# Altium schematic sheet hv.SchDoc: FastIC+ readout
size 297 x 209 mm; Organization: CERN; SheetNumber: 5; SheetTotal: 6; Projet: Fast Timing; ModifiedDate: -
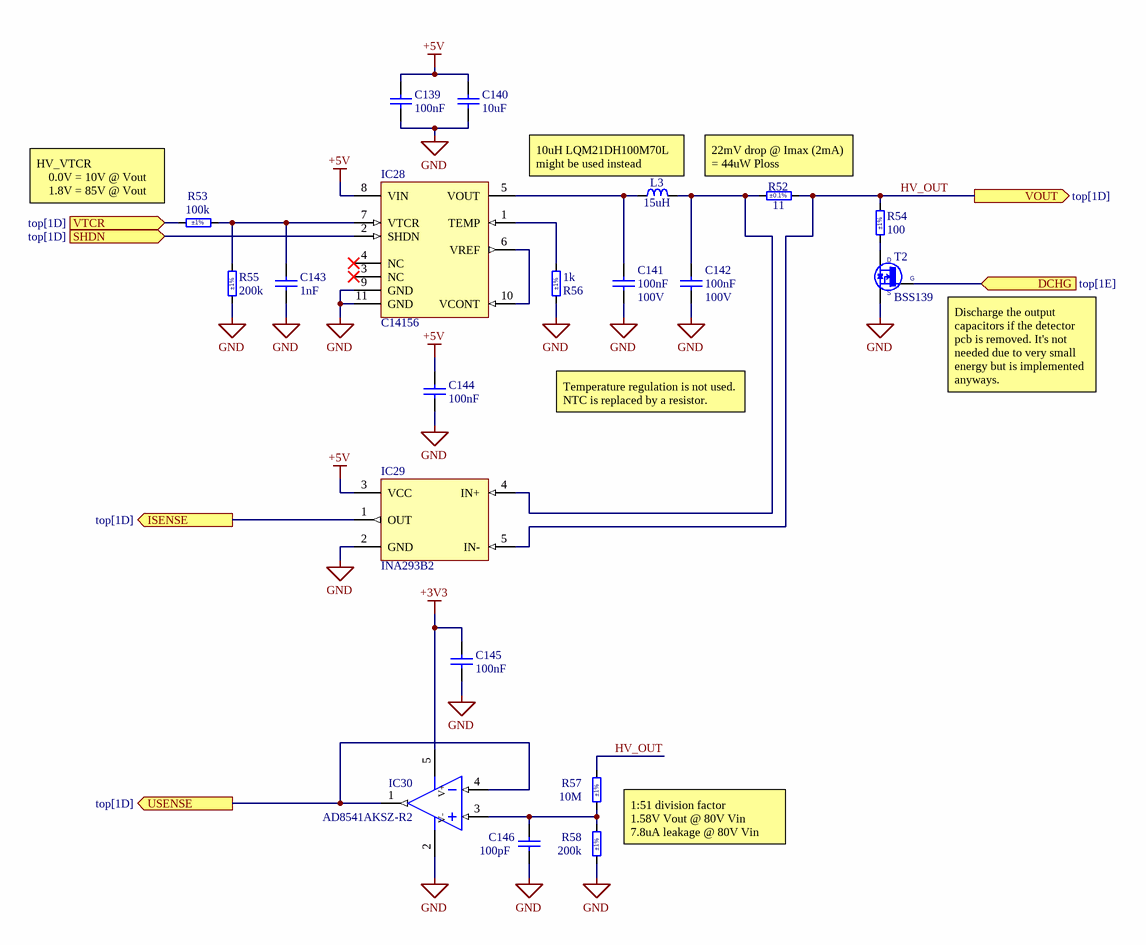
[diagram p0: hv.SchDoc]

## Parts
C139  100nF  [CAPC1005X55N]
C140  10uF  [CAPC1608X80N]
C141  100nF  Voltage: 100V  [CAPC1608X90N]
C142  100nF  Voltage: 100V  [CAPC1608X90N]
C143  1nF  [CAPC1005X55N]
C144  100nF  [CAPC1005X55N]
C145  100nF  [CAPC1005X55N]
C146  100pF  [CAPC1005X55N]
IC28  C14156  [C14156]  (no BOM)
IC29  INA293B2  [SOT95P280X145-5N]
IC30  AD8541AKSZ-R2  [SOT65P210X110-5N]
L3  15uH  [INDC2013X145N]
R52  11  Tolerance: ±0.1%  [RESC1608X55N]
R53  100k  Tolerance: ±1%  [RESC1005X40N]
R54  100  Tolerance: ±1%  [RESC1005X40N]
R55  200k  Tolerance: ±1%  [RESC1005X40N]
R56  1k  Tolerance: ±1%  [RESC1005X40N]
R57  10M  Tolerance: ±1%  [RESC1005X35N]
R58  200k  Tolerance: ±1%  [RESC1005X40N]
T2  BSS139  [SOT95P240X110-3N]

## Ports
DCHG (in, see top[1E]), ISENSE (out, see top[1D]), SHDN (in, see top[1D]), USENSE (out, see top[1D]), VOUT (out, see top[1D]), VTCR (in, see top[1D])

## Nets
+3V3: C145.2 IC30.5(V+)
+5V: C139.2 C140.1 C144.2 IC28.8(VIN) IC29.3(VCC)
GND: C139.1 C140.2 C141.1 C142.1 C143.2 C144.1 C145.1 C146.1 IC28.9(GND) IC28.11(GND) IC29.2(GND) IC30.2(V-) R55.1 R56.1 R58.1 T2.2(S)
DCHG: T2.1(G) ; port DCHG
HV_OUT: IC29.5(IN-) R52.2 R54.2 R57.2 ; port VOUT
ISENSE: IC29.1(OUT) ; port ISENSE
SHDN: IC28.2(SHDN) ; port SHDN
USENSE: IC30.1(OUT) IC30.4(IN-) ; port USENSE
VTCR: R53.1 ; port VTCR
NetC141_2: C141.2 IC28.5(VOUT) L3.1
NetC142_2: C142.2 IC29.4(IN+) L3.2 R52.1
NetC143_1: C143.1 IC28.7(VTCR) R53.2 R55.2
NetC146_2: C146.2 IC30.3(IN+) R57.1 R58.2
NetIC28_1: IC28.1(TEMP) R56.2
NetIC28_6: IC28.6(VREF) IC28.10(VCONT)
NetR54_1: R54.1 T2.3(D)

Not connected (* = marked no-connect by the designer): IC28 3(NC)* 4(NC)*

## Notes on the sheet
- (near R53) HV_VTCR
  0.0V = 10V @ Vout
  1.8V = 85V @ Vout
- (near L3) 10uH LQM21DH100M70L might be used instead
- (near R52) 22mV drop @ Imax (2mA)
  = 44uW Ploss
- (near T2) Discharge the output capacitors if the detector pcb is removed. It's not needed due to very small energy but is implemented anyways.
- Temperature regulation is not used. NTC is replaced by a resistor.
- 1:51 division factor
  1.58V Vout @ 80V Vin
  7.8uA leakage @ 80V Vin
- Project/Equipment
- Document
- Designer
- Drawn by
- Check.by
- File
- Last Mod.
- Print Date
- Sheet
- Size
- A4
- of
- Rev

## Library data of the parts
C139 C144 C145 = CC0402_100NF_16V_10%_X7R: Non-polarised capacitor; Part Description: SMD Multilayer Chip Ceramic Capacitor; Manufacturer: GENERIC; Manufacturer1 Part Number: GRM155R71C104KA88D; Voltage: 16V; TC: X7R; Tolerance: ±10%; Part Number: CC0402_100NF_16V_10%_X7R; Component Kind: Standard; Component Type: Standard; Pin Count: 2; Value: 100nF; Status: Not Recommended; Manufacturer Part Number: CC0402_100NF_16V_10%_X7R; Case: 0402; Mounted: Yes; Socket: No; SMD: Yes; Sense: No; Manufacturer1 Example: MURATA; Manufacturer1 ComponentHeight: 0.55mm; HelpURL: \\cern.ch\dfs\Applications\Altium\Datasheets\CC0402_X7R_MURATA_GRM.pdf; Author: CERN DEM JLC; CreateDate: 05/12/2013; LatestRevisionDate: 03/12/2007
C140 = CC0603_10UF_10V_10%_X5R: Non-polarised capacitor; Part Description: SMD Multilayer Chip Ceramic Capacitor; Manufacturer: GENERIC; Manufacturer1 Part Number: GRM188R61A106KE69D; Voltage: 10V; TC: X5R; Tolerance: ±10%; Part Number: CC0603_10UF_10V_10%_X5R; Component Kind: Standard; Component Type: Standard; Pin Count: 2; Value: 10uF; Status: None; Manufacturer Part Number: CC0603_10UF_10V_10%_X5R; Case: 0603; Mounted: Yes; Socket: No; SMD: Yes; Sense: No; Manufacturer1 Example: MURATA; Manufacturer1 ComponentHeight: 0.8mm; HelpURL: \\cern.ch\dfs\Applications\Altium\Datasheets\CC0603_MURATA_GRM188R61A106KE69D.pdf; Author: CERN DEM JLC; CreateDate: 31/01/2017; LatestRevisionDate: 31/01/2017
C141 C142 = CC0603_100NF_100V_10%_X7R: Non-polarised capacitor; Part Description: SMD Multilayer Chip Ceramic Capacitor; Manufacturer: GENERIC; Manufacturer1 Part Number: GRM188R72A104KA35D; TC: X7R; Tolerance: ±10%; Part Number: CC0603_100NF_100V_10%_X7R; Component Kind: Standard; Component Type: Standard; Pin Count: 2; Value: 100nF; Status: None; Manufacturer Part Number: CC0603_100NF_100V_10%_X7R; Case: 0603; Mounted: Yes; Socket: No; SMD: Yes; Sense: No; Manufacturer1 Example: MURATA; Manufacturer1 ComponentHeight: 0.9mm; HelpURL: \\cern.ch\dfs\Applications\Altium\Datasheets\CC0603_MURATA_GRM188R72A104KA35D.pdf; Author: CERN DEM JLC; CreateDate: 11/12/2013; LatestRevisionDate: 11/12/2013
C143 = CC0402_1NF_50V_10%_X7R: Non-polarised capacitor; Part Description: SMD Multilayer Chip Ceramic Capacitor; Manufacturer: GENERIC; Manufacturer1 Part Number: 223858715623; Voltage: 50V; TC: X7R; Tolerance: ±10%; Part Number: CC0402_1NF_50V_10%_X7R; Component Kind: Standard; Component Type: Standard; Pin Count: 2; Value: 1nF; Status: Not Recommended; Manufacturer Part Number: CC0402_1NF_50V_10%_X7R; Case: 0402; Mounted: Yes; Socket: No; SMD: Yes; Sense: No; Manufacturer1 Example: PHYCOMP; Manufacturer1 ComponentHeight: 0.55mm; HelpURL: \\cern.ch\dfs\Applications\Altium\Datasheets\CC0402_X7R_PHYCOMP.pdf; Author: CERN DEM JLC; CreateDate: 03/12/2007; LatestRevisionDate: 03/12/2007
C146 = CC0402_100PF_50V_5%_C0G: Non-polarised capacitor; Part Description: SMD Multilayer Chip Ceramic Capacitor; Manufacturer: GENERIC; Manufacturer1 Part Number: C0402C101J5GACTU; Voltage: 50V; TC: C0G/NP0; Tolerance: ±5%; Part Number: CC0402_100PF_50V_5%_C0G; Component Kind: Standard; Component Type: Standard; Pin Count: 2; Value: 100pF; Status: Preferred; Manufacturer Part Number: CC0402_100PF_50V_5%_C0G; Case: 0402; Mounted: Yes; Socket: No; SMD: Yes; Sense: No; Manufacturer1 Example: KEMET; Manufacturer1 ComponentHeight: 0.55mm; HelpURL: \\cern.ch\dfs\Applications\Altium\Datasheets\CC0402_C0G_KEMET_(Commercial Grade).pdf; Author: CERN DEM JLC; CreateDate: 12/3/2007; LatestRevisionDate: 4/22/2015
IC30 = AD8541AKSZ-R2: Operational Amplifier; Part Description: CMOS Rail-to-Rail General-Purpose Amplifier; Manufacturer: ANALOG DEVICES; PressFit: No; Bonding: No; Part Number: AD8541AKSZ-R2; Component Kind: Standard; Component Type: Standard; Device: AD8541AKSZ-R2; PackageDescription: SOT353, SC70-5, SOT, 0.65mm Pitch; 5 Pin, 1.25mm W X 2.00mm L X 1.10mm H body, IPC Medium Density; Manufacturer Part Number: AD8541AKS; Pin Count: 5; Case: SOT353; Mounted: Yes; Socket: No; SMD: Yes; Sense: No; ComponentHeight: 1.1mm; Author: CERN DEM JLC; HelpURL: \\cern.ch\dfs\Applications\Altium\Datasheets\AD8541AKSZ-R2.pdf; CreateDate: 4/25/2012; LatestRevisionDate: 3/29/2022
L3 = IND0805_TDK_MLZ2012M150WT000: Inductor; Part Description: SMD Multilayer Ferrite (MLZ Series); Manufacturer: TDK; Power: 100mA; Resistance: 0.95R; Tolerance: ±20%; Part Number: IND0805_TDK_MLZ2012M150WT000; Component Kind: Standard; Component Type: Standard; Pin Count: 2; Value: 15uH; Manufacturer Part Number: MLZ2012M150WT000; Case: 0805; Mounted: Yes; Socket: No; SMD: Yes; Sense: No; ComponentHeight: 1.45mm; HelpURL: \\cern.ch\dfs\Applications\Altium\Datasheets\IND0805_TDK_MLZ2012.pdf; Author: CERN DEM HF; CreateDate: 4/18/2024; LatestRevisionDate: 4/18/2024
R52 = R0603_11R_0.1%_0.063W_10PPM: Resistor - 0.1%; Part Description: Thin Film Chip Resistor; Manufacturer: GENERIC; Manufacturer1 Part Number: RN73C1J11RBTDF; Power: 0.063W; TC: ±10ppm; PressFit: No; Part Number: R0603_11R_0.1%_0.063W_10PPM; Component Kind: Standard; Component Type: Standard; Pin Count: 2; Value: 11; Status: Not Recommended; Manufacturer Part Number: R0603_11R_0.1%_0.063W_10PPM; Case: 0603; Mounted: Yes; Sense: No; Socket: No; SMD: Yes; Manufacturer1 Example: TYCO HOLSWORTHY; Manufacturer1 ComponentHeight: 0.5mm; HelpURL: \\cern.ch\dfs\Applications\Altium\Datasheets\R0603_Tyco_RN73.pdf; Author: CERN DEM JLC; CreateDate: 12/3/2007; LatestRevisionDate: 3/13/2008
R53 = R0402_100K_1%_0.0625W_100PPM: Resistor - 1%; Part Description: General Purpose Thick Film Chip Resistor; Manufacturer: GENERIC; Manufacturer1 Part Number: 232270671004L; TC: ±100ppm/°C; PressFit: No; Part Number: R0402_100K_1%_0.0625W_100PPM; Component Kind: Standard; Component Type: Standard; Pin Count: 2; Value: 100k; Status: Not Recommended; Power: 0.0625W; Manufacturer Part Number: R0402_100K_1%_0.0625W_100PPM; Case: 0402; Mounted: Yes; Sense: No; Socket: No; SMD: Yes; Manufacturer1 Example: YAGEO PHYCOMP; Manufacturer1 ComponentHeight: 0.4mm; HelpURL: \\cern.ch\dfs\Applications\Altium\Datasheets\R0402_Phycomp_RC0402.pdf; Author: CERN DEM JLC; CreateDate: 12/3/2007; LatestRevisionDate: 10/17/2012
R54 = R0402_100R_1%_0.0625W_100PPM: Resistor - 1%; Part Description: General Purpose Thick Film Chip Resistor; Manufacturer: GENERIC; Manufacturer1 Part Number: 232270671001L; TC: ±100ppm/°C; PressFit: No; Part Number: R0402_100R_1%_0.0625W_100PPM; Component Kind: Standard; Component Type: Standard; Pin Count: 2; Value: 100; Status: Not Recommended; Power: 0.0625W; Manufacturer Part Number: R0402_100R_1%_0.0625W_100PPM; Case: 0402; Mounted: Yes; Sense: No; Socket: No; SMD: Yes; Manufacturer1 Example: YAGEO PHYCOMP; Manufacturer1 ComponentHeight: 0.4mm; HelpURL: \\cern.ch\dfs\Applications\Altium\Datasheets\R0402_Phycomp_RC0402.pdf; Author: CERN DEM JLC; CreateDate: 12/3/2007; LatestRevisionDate: 10/17/2012
R55 R58 = R0402_200K_1%_0.0625W_100PPM: Resistor - 1%; Part Description: General Purpose Thick Film Chip Resistor; Manufacturer: GENERIC; Manufacturer1 Part Number: 232270672004L; TC: ±100ppm/°C; PressFit: No; Part Number: R0402_200K_1%_0.0625W_100PPM; Component Kind: Standard; Component Type: Standard; Pin Count: 2; Value: 200k; Status: Not Recommended; Power: 0.0625W; Manufacturer Part Number: R0402_200K_1%_0.0625W_100PPM; Case: 0402; Mounted: Yes; Sense: No; Socket: No; SMD: Yes; Manufacturer1 Example: YAGEO PHYCOMP; Manufacturer1 ComponentHeight: 0.4mm; HelpURL: \\cern.ch\dfs\Applications\Altium\Datasheets\R0402_Phycomp_RC0402.pdf; Author: CERN DEM JLC; CreateDate: 12/3/2007; LatestRevisionDate: 10/17/2012
R56 = R0402_1K_1%_0.0625W_100PPM: Resistor - 1%; Part Description: General Purpose Thick Film Chip Resistor; Manufacturer: GENERIC; Manufacturer1 Part Number: 232270671002L; TC: ±100ppm/°C; PressFit: No; Part Number: R0402_1K_1%_0.0625W_100PPM; Component Kind: Standard; Component Type: Standard; Pin Count: 2; Value: 1k; Status: Not Recommended; Power: 0.0625W; Manufacturer Part Number: R0402_1K_1%_0.0625W_100PPM; Case: 0402; Mounted: Yes; Sense: No; Socket: No; SMD: Yes; Manufacturer1 Example: YAGEO PHYCOMP; Manufacturer1 ComponentHeight: 0.4mm; HelpURL: \\cern.ch\dfs\Applications\Altium\Datasheets\R0402_Phycomp_RC0402.pdf; Author: CERN DEM JLC; CreateDate: 12/3/2007; LatestRevisionDate: 10/17/2012
R57 = R0402_100K_0.1%_0.063W_25PPM: Resistor - 1%; Part Description: Thin Film Precision Resistor; Manufacturer: GENERIC; Manufacturer1 Part Number: CPF0402B100KE1; Value: 100k; Power: 0.063W; TC: ±25ppm/°C; PressFit: No; Part Number: R0402_100K_0.1%_0.063W_25PPM; Component Kind: Standard; Component Type: Standard; Pin Count: 2; Status: Not Recommended; Manufacturer Part Number: R0402_100K_0.1%_0.063W_25PPM; Case: 0402; Mounted: Yes; Sense: No; Socket: No; SMD: Yes; Manufacturer1 Example: TE CONNECTIVITY; Manufacturer1 ComponentHeight: 0.35mm; HelpURL: \\cern.ch\dfs\Applications\Altium\Datasheets\R0402_TYCO_CPF.pdf; Author: CERN DEM JMW; CreateDate: 9/22/2015; LatestRevisionDate: 9/22/2015
T2 = BSS139: N-CHANNEL MOSFET WITH DIODE; Part Description: 250V, 30mA N-Channel  SIPMOS® Small-Signal-Transistor; Manufacturer: INFINEON; PressFit: No; Bonding: No; Part Number: BSS139; Component Kind: Standard; Component Type: Standard; Device: BSS139; PackageDescription: SOT23, 0.95mm Pitch; 3 Pin, 1.40mm W X 3.00mm L X 1.10mm H body, IPC Medium Density; Manufacturer Part Number: BSS139; Pin Count: 3; Case: SOT23-3; Mounted: Yes; Socket: No; SMD: Yes; Sense: No; ComponentHeight: 1.1mm; HelpURL: \\cern.ch\dfs\Applications\Altium\Datasheets\BSS139.pdf; Author: CERN DEM JLC; CreateDate: 9/23/2014; LatestRevisionDate: 9/23/2014